# EAGLE design duck_esp (EAGLE 9.6.2)
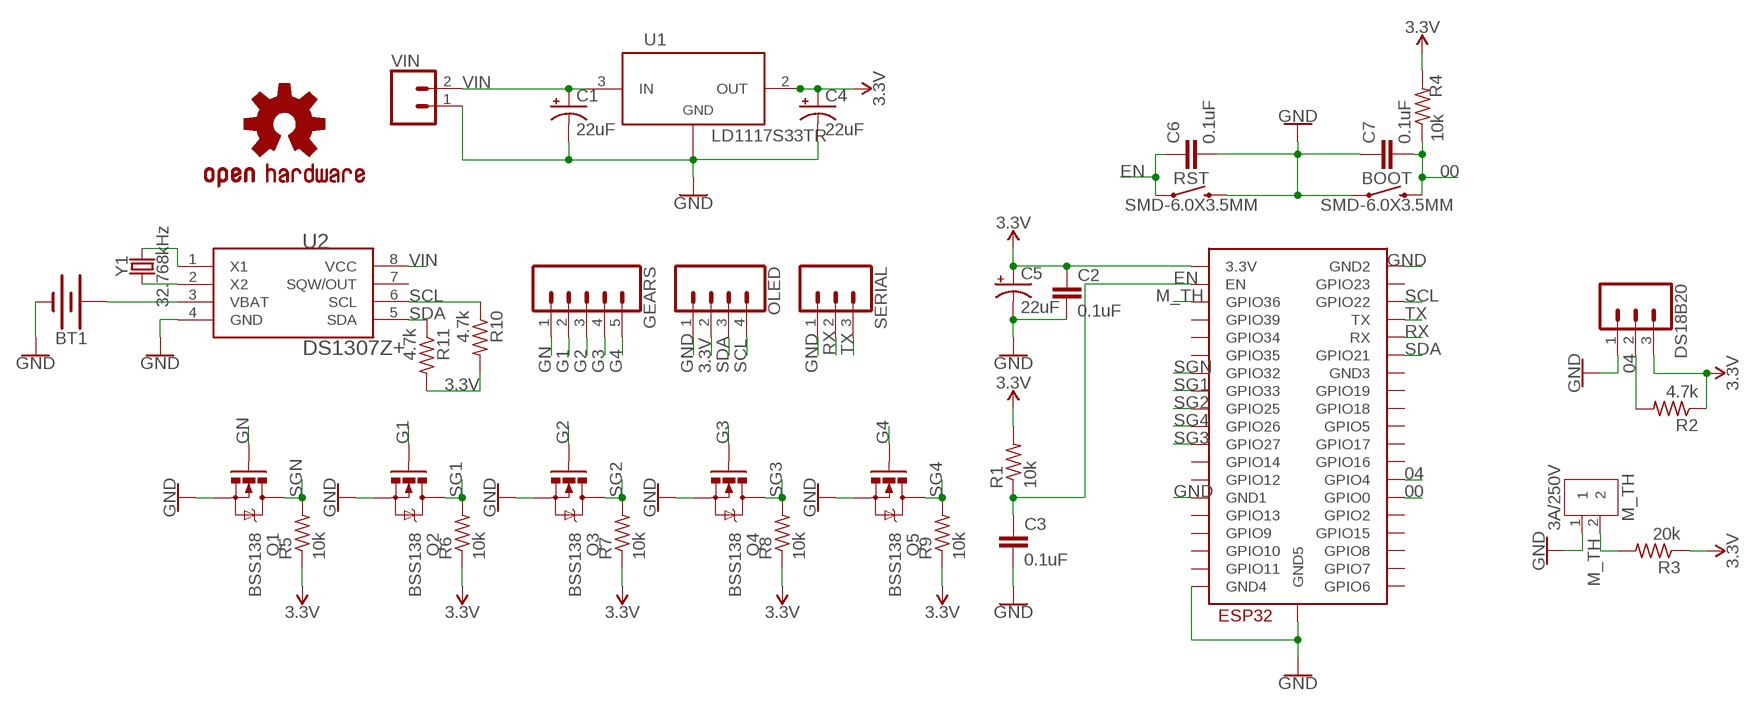
[diagram p0: schematic, sheet 1]

## Parts
BOOT  SMD-6.0X3.5MM  MOMENTARY-SWITCH-SPST-SMD-6.0X3.5MM  [TACTILE_SWITCH_SMD_6.0X3.5MM]
BT1  BATTERY-12MM_SMD  [BATTCON_12MM]
C1  22uF  CPOL-USE2-5  [E2-5]
C2  0.1uF  22UF-0805-6.3V-20%  [0805]
C3  0.1uF  22UF-0805-6.3V-20%  [0805]
C4  22uF  CPOL-USE2-5  [E2-5]
C5  22uF  CPOL-USE2-5  [E2-5]
C6  0.1uF  22UF-0805-6.3V-20%  [0805]
C7  0.1uF  22UF-0805-6.3V-20%  [0805]
DS18B20  CONN_03  [1X03]
GEARS  CONN_05  [1X05]
LOGO1  OSHW-LOGOL-COPPER  [OSHW-LOGO-L_COPPER]
M_TH  3A/250V  B2B-XH-A  [B2B-XH-A]
OLED  CONN_04  [1X04]
Q1  BSS138  MOSFET-NCHANNELBSS138  [SOT23]
Q2  BSS138  MOSFET-NCHANNELBSS138  [SOT23]
Q3  BSS138  MOSFET-NCHANNELBSS138  [SOT23]
Q4  BSS138  MOSFET-NCHANNELBSS138  [SOT23]
Q5  BSS138  MOSFET-NCHANNELBSS138  [SOT23]
R1  10k  R-US_R0805  [R0805]
R2  4.7k  R-US_R0805  [R0805]
R3  20k  R-US_R0805  [R0805]
R4  10k  R-US_R0805  [R0805]
R5  10k  R-US_R0805  [R0805]
R6  10k  R-US_R0805  [R0805]
R7  10k  R-US_R0805  [R0805]
R8  10k  R-US_R0805  [R0805]
R9  10k  R-US_R0805  [R0805]
R10  4.7k  R-US_R0805  [R0805]
R11  4.7k  R-US_R0805  [R0805]
RST  SMD-6.0X3.5MM  MOMENTARY-SWITCH-SPST-SMD-6.0X3.5MM  [TACTILE_SWITCH_SMD_6.0X3.5MM]
SERIAL  CONN_03  [1X03]
U1  LD1117S33TR  [SOT-223]
U2  DS1307Z+  [SOIC-8N]
U$1  ESP32-WROOM  [ESP32-WROOM]
VIN  CONN_02POLAR  [MOLEX-1X2]
Y1  32.768kHz  CRYSTAL-32.768KHZSMD-2X6  [CRYSTAL-SMD-2X6-CYL]

## Nets
00: BOOT.2 C7.2 R4.1 U$1.IO0(GPIO0)
3.3V: C2.1 C4.+ C5.+ DS18B20.3 OLED.2 R1.2 R2.1 R3.1 R4.2 R5.1 R6.1 R7.1 R8.1 R9.1 R10.2 R11.2 U1.2(OUT) U1.4 U$1.3V3(3.3V)
04: DS18B20.2 R2.2 U$1.IO4(GPIO4)
EN: C3.1 C6.1 R1.1 RST.1 U$1.EN
G1: GEARS.2 Q2.1(G)
G2: GEARS.3 Q3.1(G)
G3: GEARS.4 Q4.1(G)
G4: GEARS.5 Q5.1(G)
GN: GEARS.1 Q1.1(G)
GND: BOOT.1 BT1.GND(-) C1.- C2.2 C3.2 C4.- C5.- C6.2 C7.1 DS18B20.1 M_TH.1 OLED.1 Q1.2(S) Q2.2(S) Q3.2(S) Q4.2(S) Q5.2(S) RST.2 SERIAL.1 U1.1(ADJ/GND) U2.4(GND) U$1.GND1 U$1.GND2 U$1.GND4 U$1.GND5 VIN.1
M_TH: M_TH.2 R3.2 U$1.SENSOR_VP(GPIO36)
RX: SERIAL.2 U$1.RX
SCL: OLED.4 R10.1 U2.6(SCL) U$1.IO22(GPIO22)
SDA: OLED.3 R11.1 U2.5(SDA) U$1.IO21(GPIO21)
SG1: Q2.3(D) R6.2 U$1.IO33(GPIO33)
SG2: Q3.3(D) R7.2 U$1.IO25(GPIO25)
SG3: Q4.3(D) R8.2 U$1.IO27(GPIO27)
SG4: Q5.3(D) R9.2 U$1.IO26(GPIO26)
SGN: Q1.3(D) R5.2 U$1.IO32(GPIO32)
TX: SERIAL.3 U$1.TX
VBAT: BT1.PWR@1(+) U2.3(VBAT)
VIN: C1.+ U1.3(IN) U2.8(VCC) VIN.2
X1: U2.1(X1) Y1.X2
X2: U2.2(X2) Y1.X1
Unconnected: U2.7(SQW/OUT) U$1.CLK(GPIO6) U$1.CMD(GPIO11) U$1.GND3 U$1.IO2(GPIO2) U$1.IO5(GPIO5) U$1.IO12(GPIO12) U$1.IO13(GPIO13) U$1.IO14(GPIO14) U$1.IO15(GPIO15) U$1.IO16(GPIO16) U$1.IO17(GPIO17) U$1.IO18(GPIO18) U$1.IO19(GPIO19) U$1.IO23(GPIO23) U$1.IO34(GPIO34) U$1.IO35(GPIO35) U$1.SD0(GPIO7) U$1.SD1(GPIO8) U$1.SD2(GPIO9) U$1.SD3(GPIO10) U$1.SENSOR_VN(GPIO39)

## Library data of the parts
BOOT RST = SparkFun-Switches:MOMENTARY-SWITCH-SPST: Momentary Switch (Pushbutton) - SPST Normally-open (NO) SPST momentary switches (buttons, pushbuttons). Variants PTH-12MM - 12mm square, through-hole Momentary Pushbutton Switch - 12mm Square <https://www.sparkfun.com/products/9190> (COM-09190) PTH-6.0MM, PTH-6.0MM-KIT - 6.0mm square, through-hole Mini Pushbutton Switch <https://www.sparkfun.com/products/97> (COM-00097) KIT package intended for soldering kit's - only one side of pads' copper is exposed. PTH-RIGHT-ANGLE-KIT - Right-angle, through-hole Right Angle Tactile Button <https://www.sparkfun.com/products/10791> - Used on SparkFun BigTime Watch Kit <https://www.sparkfun.com/products/11734> SMD-12MM - 12mm square, surface-mount Tactile Button - SMD (12mm) <https://www.sparkfun.com/products/12993> (COM-12993) Used on SparkFun PicoBoard <https://www.sparkfun.com/products/11888> SMD-4.5MM - 4.5mm Square Trackball Switch Used on SparkFun Blackberry Trackballer Breakout <https://www.sparkfun.com/products/13169> SMD-4.6MMX2.8MM - 4.60mm x 2.80mm, surface mount Used on SparkFun SAMD21 Mini Breakout <https://www.sparkfun.com/products/13664> SMD-5.2MM, SMD-5.2-REDUNDANT - 5.2mm square, surface-mount Mini Pushbutton Switch - SMD <https://www.sparkfun.com/products/8720> (COM-08720) Used on Arduino Pro Mini <https://www.sparkfun.com/products/11114> REDUNDANT package connects both switch circuits together SMD-6.0X3.5MM - 6.0 x 3.5mm, surface mount Momentary Reset Switch SMD <https://www.sparkfun.com/products/8229> (COM-08229) SMD-6.2MM-TALL - 6.2mm square, surface mount Tactile Button - SMD (6mm) <https://www.sparkfun.com/products/12992> Used on SparkFun Digital Sandbox <https://www.sparkfun.com/products/12651> SMD-RIGHT-ANGLE - Right-angle, surface mount Used on SparkFun Block for Intel® Edison - Arduino <https://www.sparkfun.com/products/13036>; PROD_ID: SWCH-00815; SF_SKU: COM-08229
BT1 = SparkFun-Batteries:BATTERY: Battery - Single Cell A variety of battery chemistries, sizes, and footprints. Device List: 20MM_PTH - Coin Cell Battery Holder - 20mm (PTH) <https://www.sparkfun.com/products/783> 6.8MM_PTH - Coin Cell Battery Holder - 6.8MM(SMD) <https://www.digikey.com/product-detail/en/seiko-instruments/MS621FE-FL11E/728-1057-ND/1889208?WT.srch=1&gclid=CNOQ5a6LzdQCFZS2wAodXCkE0g> 12MM_SMD - Coin Cell Battery Holder - 12mm (SMD) <https://www.sparkfun.com/products/10592> 12MM_PTH - Coin Cell Battery Holder - 12mm (PTH) <https://www.sparkfun.com/products/7948> 20MM_SMD - 20mm Coin Cell Battery Holder (SMD) (2 legs) Used on the Big Time Watch Kit <https://www.sparkfun.com/products/11734> 20MM_SMD_4LEGS - Coin Cell Battery Holder - 20mm (SMD) <https://www.sparkfun.com/products/11892> 20MM_SMD_4LEGS_OVERPASTE - Coin Cell Battery Holder - 20mm (SMD) <https://www.sparkfun.com/products/11892> (Over-paste on the legs) 24.5MM_PTH - Coin Cell Battery Holder - 24.5mm (PTH) <https://www.sparkfun.com/products/8863> 9V - 9V Battery Holder - PC Mount Used on the SparkFun SparkPunk Sound Kit <https://www.sparkfun.com/products/11177> and SparkFun SparkPunk Sequencer Kit <https://www.sparkfun.com/products/12707> 18650 - Battery Holder - 18650 (PTH) <https://www.sparkfun.com/products/13113> AA - Battery Holder - 1xAA (PTH) <https://www.sparkfun.com/products/7949> AAA - Battery Holder - 1xAAA (PTH) <https://www.sparkfun.com/products/12718> AA_KIT - Battery Holder - 1xAA (PTH) <https://www.sparkfun.com/products/7949> Special kit package - pads only have exposed copper on one side of the board. AAA_KIT - Battery Holder - 1xAAA (PTH) <https://www.sparkfun.com/products/12718> Special kit package - pads only have exposed copper on one side of the board.; PROD_ID: BATT-08044; SF_SKU: PRT-10592
C1 C4 C5 = rcl:CPOL-US: POLARIZED CAPACITOR, American symbol; SPICEPREFIX: C
C2 C3 C6 C7 = SparkFun-Capacitors:22UF: 22µF ceramic capacitors A capacitor is a passive two-terminal electrical component used to store electrical energy temporarily in an electric field.; PROD_ID: CAP-08402; VALUE: 22uF
DS18B20 SERIAL = SparkFun-Connectors:CONN_03: Multi connection point. Often used as Generic Header-pin footprint for 0.1 inch spaced/style header connections On any of the 0.1 inch spaced packages, you can populate with these: Break Away Headers - Straight <https://www.sparkfun.com/products/116> (PRT-00116) Break Away Male Headers - Right Angle <https://www.sparkfun.com/products/553> (PRT-00553) Female Headers <https://www.sparkfun.com/products/115> (PRT-00115) Break Away Headers - Machine Pin <https://www.sparkfun.com/products/117> (PRT-00117) Break Away Female Headers - Swiss Machine Pin <https://www.sparkfun.com/products/743> (PRT-00743) Stackable Header - 3 Pin (Female, 0.1") <https://www.sparkfun.com/products/13875> (PRT-13875) For SCREWTERMINALS and SPRING TERMINALS visit here: Screw Terimnals on SparkFun.com <https://www.sparkfun.com/search/results?term=Screw+Terminals> (5mm/3.5mm/2.54mm spacing) This device is also useful as a general connection point to wire up your design to another part of your project. Our various solder wires solder well into these plated through hole pads. Hook-Up Wire - Assortment (Stranded, 22 AWG) <https://www.sparkfun.com/products/11375> (PRT-11375) Hook-Up Wire - Assortment (Solid Core, 22 AWG) <https://www.sparkfun.com/products/11367> (PRT-11367) View the entire wire category on our website here <https://www.sparkfun.com/categories/141> Special notes: Molex polarized connector foot print use with SKU : PRT-08232 with associated crimp pins and housings.
GEARS = SparkFun-Connectors:CONN_05: Multi connection point. Often used as Generic Header-pin footprint for 0.1 inch spaced/style header connections On any of the 0.1 inch spaced packages, you can populate with these: Break Away Headers - Straight <https://www.sparkfun.com/products/116> (PRT-00116) Break Away Male Headers - Right Angle <https://www.sparkfun.com/products/553> (PRT-00553) Female Headers <https://www.sparkfun.com/products/115> (PRT-00115) Break Away Headers - Machine Pin <https://www.sparkfun.com/products/117> (PRT-00117) Break Away Female Headers - Swiss Machine Pin <https://www.sparkfun.com/products/743> (PRT-00743) For SCREWTERMINALS and SPRING TERMINALS visit here: Screw Terimnals on SparkFun.com <https://www.sparkfun.com/search/results?term=Screw+Terminals> (5mm/3.5mm/2.54mm spacing) This device is also useful as a general connection point to wire up your design to another part of your project. Our various solder wires solder well into these plated through hole pads. Hook-Up Wire - Assortment (Stranded, 22 AWG) <https://www.sparkfun.com/products/11375> (PRT-11375) Hook-Up Wire - Assortment (Solid Core, 22 AWG) <https://www.sparkfun.com/products/11367> (PRT-11367) View the entire wire category on our website here <https://www.sparkfun.com/categories/141> Special notes: Molex polarized connector foot print use with SKU : PRT-08231 with associated crimp pins and housings. 1MM SMD Version SKU: PRT-10208
LOGO1 = SparkFun-Aesthetics:OSHW-LOGO: Open-Source Hardware (OSHW) Logo This logo indicates the piece of hardware it is found on incorporates a OSHW license and/or adheres to the definition of open source hardware found here: http://freedomdefined.org/OSHW
M_TH = Connector:B2B-XH-A: XH Connector Top Entry - 2POS Details see: Datasheet <http://www.jst-mfg.com/product/pdf/eng/eXH.pdf>; CATEGORY: CONNECTOR; DESCRIPTION: 2.5mm pitch/disconnectable crimp style connector; MANUFACTURER: JST (XH CONNECTOR); MPN: B2B-XH-A; OPERATING_TEMPERATURE: -25°C ~ 85°C; PART_STATUS: ACTIVE; ROHS_COMPLIANT: COMPLIANT; SERIES: B_B-XH-A; SUB_CATEGORY: Through hole connector; TYPE: top entry
OLED = SparkFun-Connectors:CONN_04: Multi connection point. Often used as Generic Header-pin footprint for 0.1 inch spaced/style header connections On any of the 0.1 inch spaced packages, you can populate with these: Break Away Headers - Straight <https://www.sparkfun.com/products/116> (PRT-00116) Break Away Male Headers - Right Angle <https://www.sparkfun.com/products/553> (PRT-00553) Female Headers <https://www.sparkfun.com/products/115> (PRT-00115) Break Away Headers - Machine Pin <https://www.sparkfun.com/products/117> (PRT-00117) Break Away Female Headers - Swiss Machine Pin <https://www.sparkfun.com/products/743> (PRT-00743) For SCREWTERMINALS and SPRING TERMINALS visit here: Screw Terimnals on SparkFun.com <https://www.sparkfun.com/search/results?term=Screw+Terminals> (5mm/3.5mm/2.54mm spacing) This device is also useful as a general connection point to wire up your design to another part of your project. Our various solder wires solder well into these plated through hole pads. Hook-Up Wire - Assortment (Stranded, 22 AWG) <https://www.sparkfun.com/products/11375> (PRT-11375) Hook-Up Wire - Assortment (Solid Core, 22 AWG) <https://www.sparkfun.com/products/11367> (PRT-11367) View the entire wire category on our website here <https://www.sparkfun.com/categories/141> Special notes: Molex polarized connector foot print use with SKU : PRT-08231 with associated crimp pins and housings. 1MM SMD Version SKU: PRT-10208; PROD_ID: CONN-09696
Q1-Q5 = BeagleBone_Blue_R3:MOSFET-NCHANNEL: Common NMOSFET Parts MFG P/N Store ID Prod ID FDD8780 TRANS-09984 SI7820DN TRANS-11055 FDS6630A IC-08089 2N7002PW TRANS-11151 FQP30N06L COM-10213 TRANS-10060 BSS123LT1G TRANS-08345 BSS138 TRANS-00830 BS170 2N7000; PROD_ID: TRANS-00830
R1-R11 = resistor:R-US_: RESISTOR, American symbol
U1 = IC:LD1117S33TR: IC REG LINEAR 3.3V 800MA SOT223 Manufacturer's datasheet <http://www.st.com/content/ccc/resource/technical/document/datasheet/99/3b/7d/91/91/51/4b/be/CD00000544.pdf/files/CD00000544.pdf/jcr:content/translations/en.CD00000544.pdf>; CREATED_BY: PCBLayout.com; DIGIKEY_PART_NUMBER: 497-1242-2-ND; MANUFACTURER: STMicroelectronics; MPN: LD1117S33TR; PACKAGE: SOT-223
U2 = IC:DS1307Z+: IC RTC CLK/CALENDAR I2C 8-SOIC Manufacturer's datasheet <https://datasheets.maximintegrated.com/en/ds/DS1307.pdf>; CREATED_BY: PCBLayout.com; DIGI-KEY_PART_NUMBER: DS1307Z+-ND; MANUFACTURER: Maxim Integrated; MPN: DS1307Z+; PACKAGE: SOIC-8
U$1 = ESP32:ESP32-WROOM
VIN = SparkFun-Connectors:CONN_02: Multi connection point. Often used as Generic Header-pin footprint for 0.1 inch spaced/style header connections On any of the 0.1 inch spaced packages, you can populate with these: Break Away Headers - Straight <https://www.sparkfun.com/products/116> (PRT-00116) Break Away Male Headers - Right Angle <https://www.sparkfun.com/products/553> (PRT-00553) Female Headers <https://www.sparkfun.com/products/115> (PRT-00115) Break Away Headers - Machine Pin <https://www.sparkfun.com/products/117> (PRT-00117) Break Away Female Headers - Swiss Machine Pin <https://www.sparkfun.com/products/743> (PRT-00743) For SCREWTERMINALS and SPRING TERMINALS visit here: Screw Terimnals on SparkFun.com <https://www.sparkfun.com/search/results?term=Screw+Terminals> (5mm/3.5mm/2.54mm spacing) This device is also useful as a general connection point to wire up your design to another part of your project. Our various solder wires solder well into these plated through hole pads. Hook-Up Wire - Assortment (Stranded, 22 AWG) <https://www.sparkfun.com/products/11375> (PRT-11375) Hook-Up Wire - Assortment (Solid Core, 22 AWG) <https://www.sparkfun.com/products/11367> (PRT-11367) View the entire wire category on our website here <https://www.sparkfun.com/categories/141> Special notes: Molex polarized connector foot print use with: PRT-08233 with associated crimp pins and housings. 2.54_SCREWTERM for use with PRT-10571. 3.5mm Screw Terminal footprints for PRT-08084 5mm Screw Terminal footprints for use with PRT-08432; SF_ID: PRT-09918
Y1 = SparkFun-Clocks:CRYSTAL-32.768KHZ: 32.768kHz Crystal Frequency: 32.768kHz Frequency Stability: ±20ppm Load Capacitance: 12.5pF (PTH-2X6 & SMD-3.2X1.5), 6pF (SMD-2X6) SparkFun Products: SparkFun BigTime Watch Kit <https://www.sparkfun.com/products/11734> SparkFun nRF52832 Breakout <https://www.sparkfun.com/products/13990> SparkFun Real Time Clock Module <https://www.sparkfun.com/products/12708>; PROD_ID: XTAL-07894

## Board
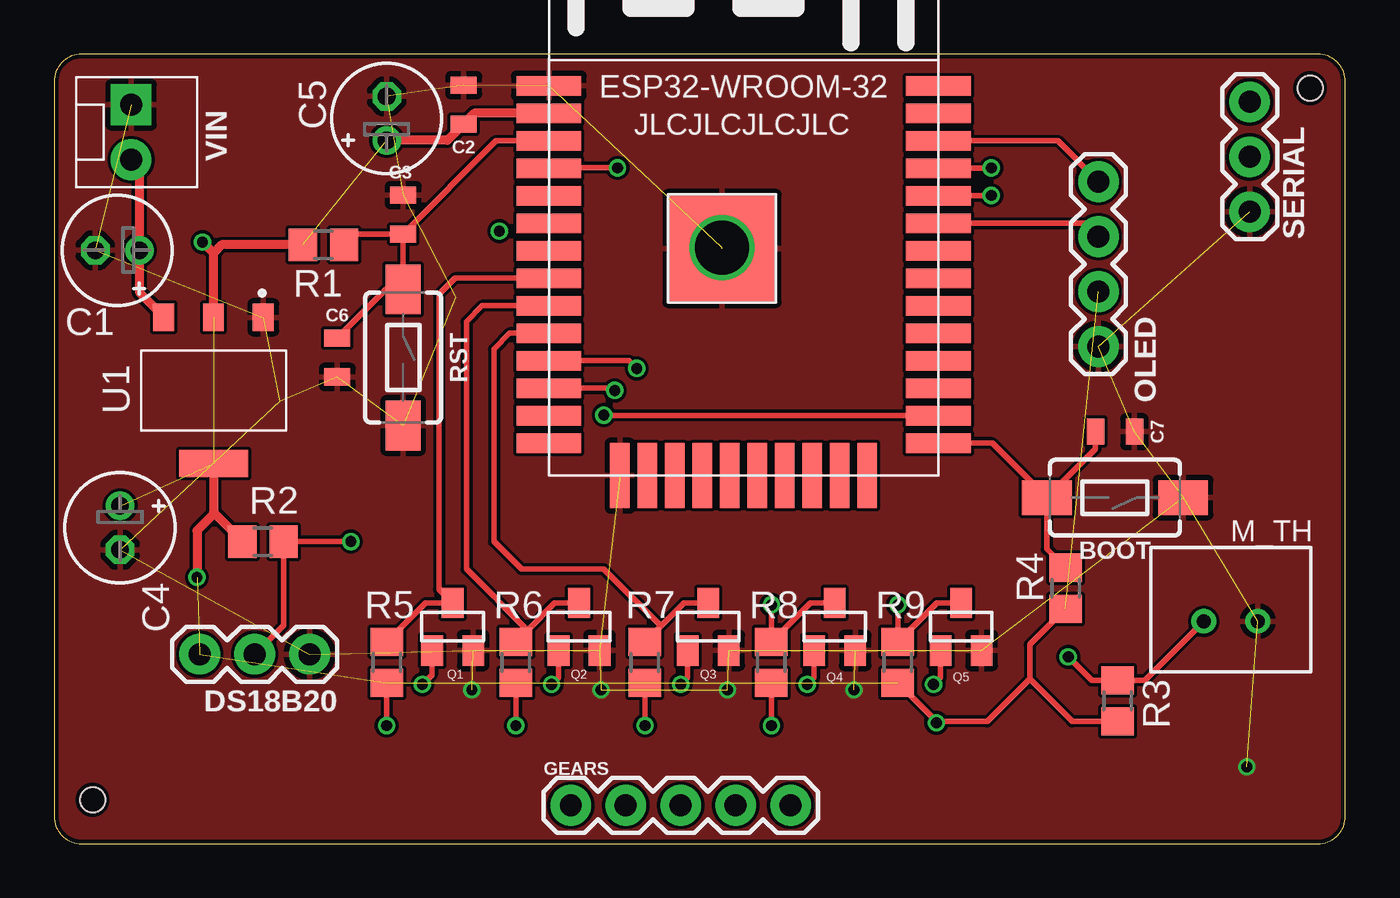
[diagram p1: board, top side]
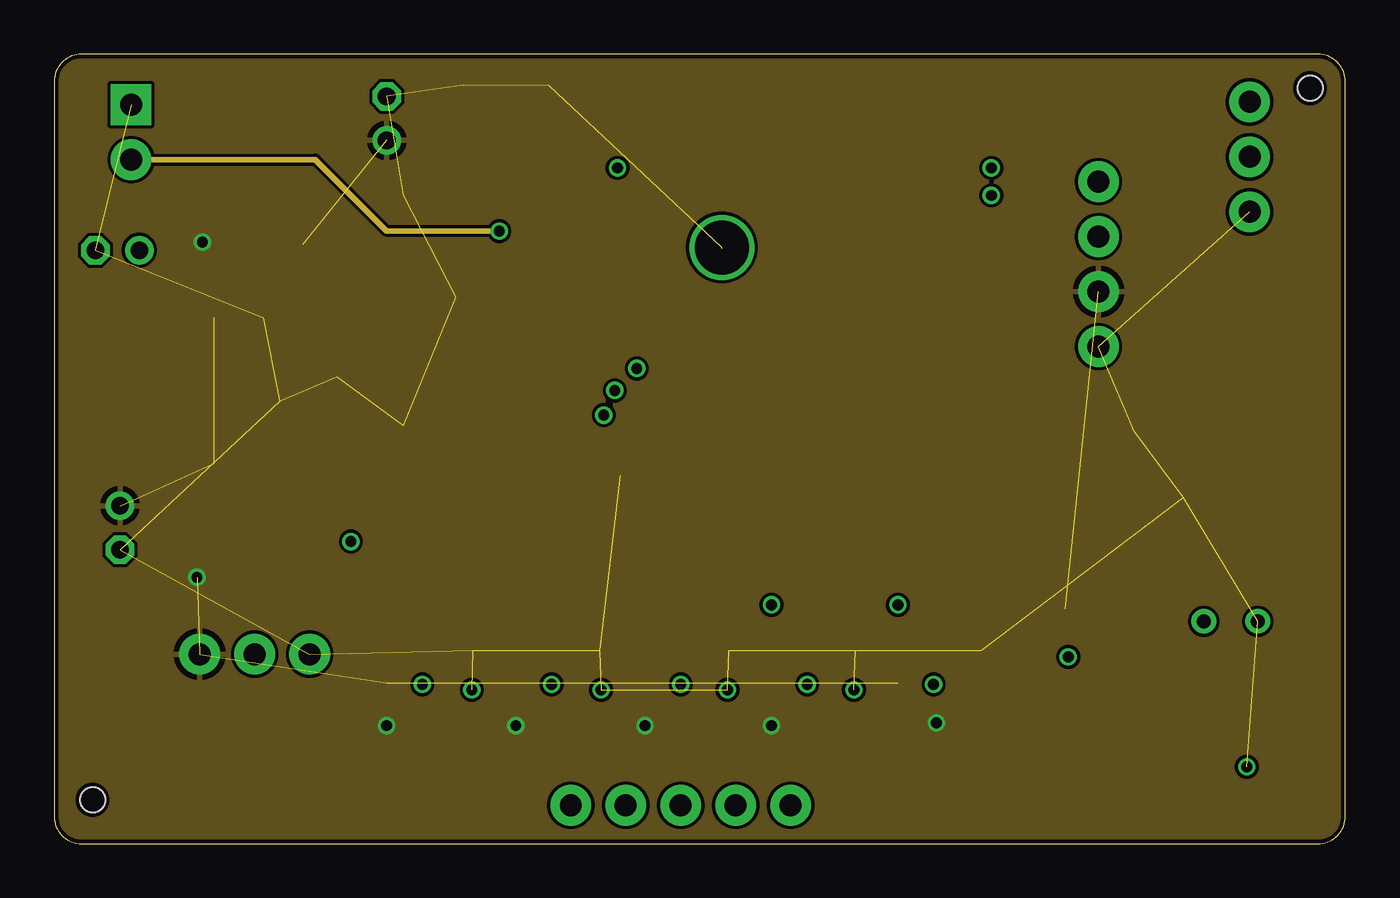
[diagram p2: board, inner layer Route2]
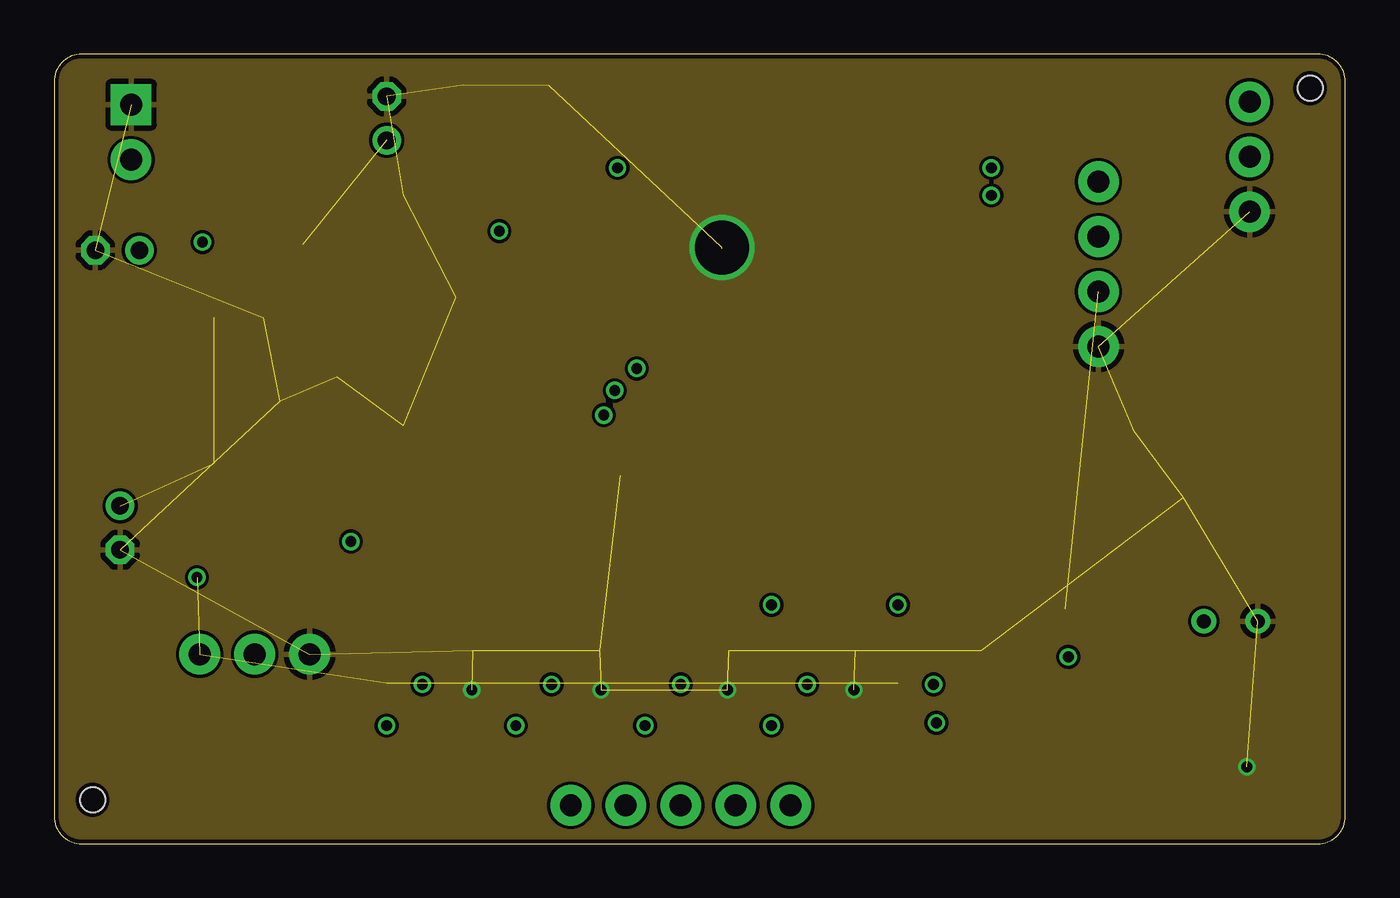
[diagram p3: board, inner layer Route15]
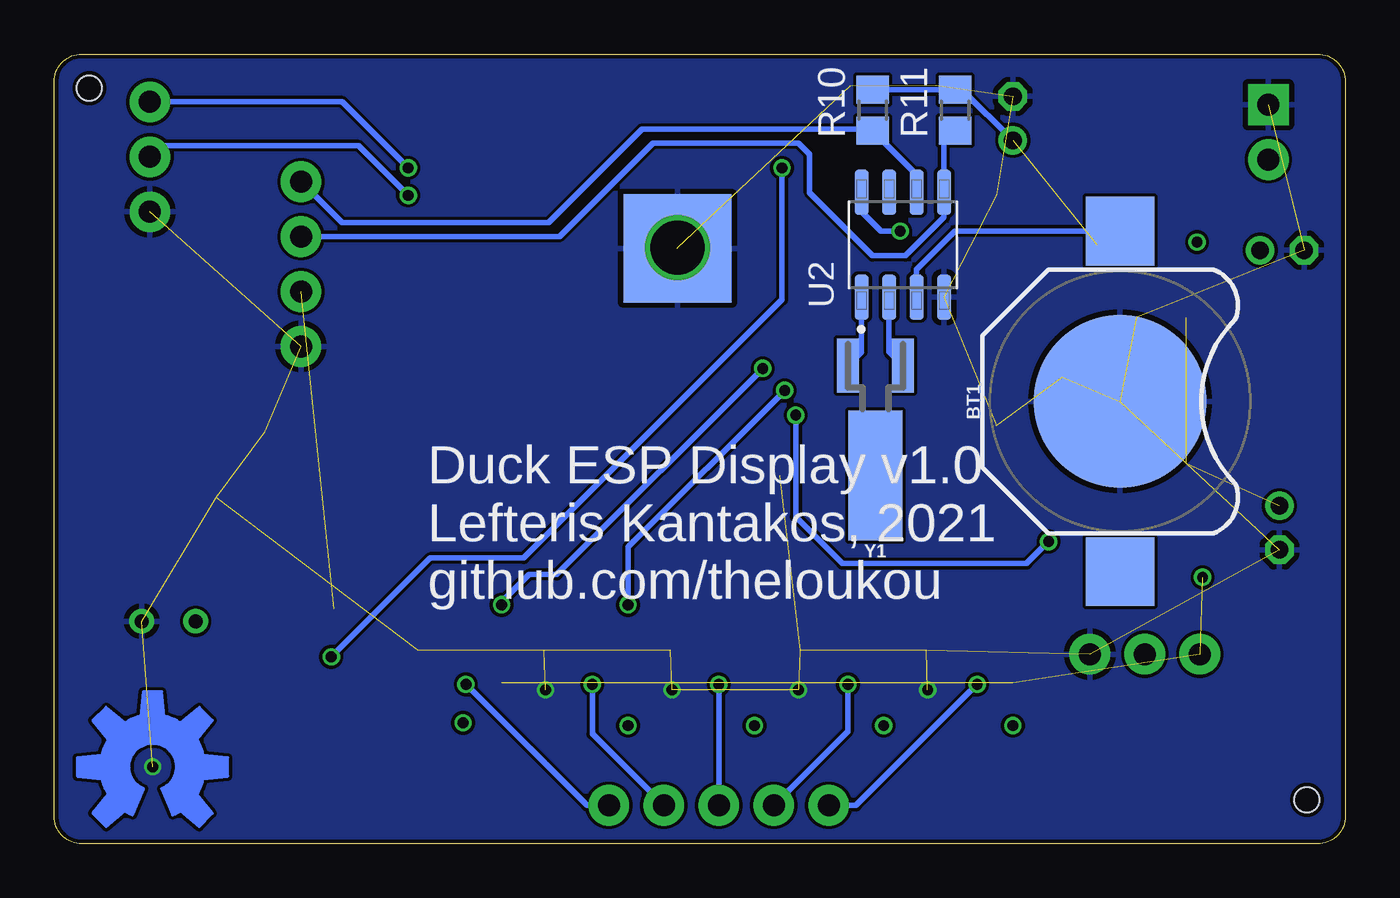
[diagram p4: board, bottom side, seen from below]

Size 59.67 x 36.5 mm. Coordinates in mm from the lower left corner, seen from the top.
Outline: 0,35.23 0,1.27 arc90 1.27,0 58.4,0 arc90 59.67,1.27 59.67,35.23 arc90 58.4,36.5 1.27,36.5 arc90 0,35.23
Copper layers (1*2*15*16): Top 0.035mm / dielectric 0.2mm / Route2 0.018mm / dielectric 1.5mm / Route15 0.018mm / dielectric 0.2mm / Bottom 0.035mm
Design rules "aisler_4_layer *": minimum track width 0.1mm, minimum drill 0.2mm, track to track 0.15mm, track to pad 0.1mm, pad to pad 0.1mm, via to via 0.1mm, smd to smd 0.1mm, copper to edge 0.2mm, drill to drill 0.21mm, minimum pad ring 0.25mm, minimum via ring 0.15mm, stop-mask expansion 0mil, vias tented up to drill 0mil, thermal gap 10mil
Holes 1.15 mm at 1.78,2.03 58.04,34.92

### Footprints (pad centres in the part's own frame; a part is rotated, then mirrored left to right if it is on the bottom)
TACTILE_SWITCH_SMD_6.0X3.5MM = smd 2.3 x 1.6: 1 -3.15,0; 2 3.15,0
BATTCON_12MM = smd 8 x 8: GND 0,0 | smd 3.175 x 3.175: PWR@1 -7.874,0; PWR@2 7.874,0
E2-5 = drill 0.813 pad 1.27: + -1.016,0 | drill 0.813 pad 1.27 octagon: - 1.016,0
0805 = smd 0.8 x 1.2: 1 -0.9,0; 2 0.9,0
1X03 = drill 1.016 pad 1.88: 1 0,0; 2 2.54,0; 3 5.08,0
1X05 = drill 1.016 pad 1.88: 1 0,0; 2 2.54,0; 3 5.08,0; 4 7.62,0; 5 10.16,0
B2B-XH-A = drill 0.64: 1 0,0; 2 2.5,0
1X04 = drill 1.016 pad 1.88: 1 0,0; 2 2.54,0; 3 5.08,0; 4 7.62,0
SOT23 = smd 1 x 1.4: 1 -0.95,-1.1; 2 0.95,-1.1; 3 0,1.1
R0805 = smd 1.3 x 1.5: 1 -0.95,0; 2 0.95,0
SOT-223 = smd 1.26 x 0.96: 1 -3.375,2.3; 2 -3.375,0; 3 -3.375,-2.3 | smd 1.26 x 3.19: 4 3.375,0
SOIC-8N = smd 2.07 x 0.65: 1 -2.425,1.905; 2 -2.425,0.635; 3 -2.425,-0.635; 4 -2.425,-1.905; 5 2.425,-1.905; 6 2.425,-0.635; 7 2.425,0.635; 8 2.425,1.905
ESP32-WROOM = smd 3 x 0.9: 3V3 0,16.74; EN 0,15.47; GND1 0,18.01; GND3 18,18.01; IO0 18,1.5; IO4 18,2.77; IO5 18,6.58; IO12 0,1.5; IO14 0,2.77; IO16 18,4.04; IO17 18,5.31; IO18 18,7.85; IO19 18,9.12; IO21 18,11.66; IO22 18,15.47; IO23 18,16.74; IO25 0,6.58; IO26 0,5.31; IO27 0,4.04; IO32 0,9.12; IO33 0,7.85; IO34 0,11.66; IO35 0,10.39; NC 18,10.39; RX 18,12.93; SENSOR_VN 0,12.93; SENSOR_VP 0,14.2; TX 18,14.2 | smd 0.9 x 3: CLK 9.635,0; CMD 8.365,0; GND2 3.285,0; IO2 14.715,0; IO13 4.555,0; IO15 13.445,0; SD0 10.905,0; SD1 12.175,0; SD2 5.825,0; SD3 7.095,0 | smd 5 x 5: GND4 8,10.5 | smd 5 x 5 bottom: GND5 8,10.5
MOLEX-1X2 = drill 1.016 pad 1.88 square: 1 0,0 | drill 1.016 pad 1.88: 2 2.54,0
CRYSTAL-SMD-2X6-CYL = smd 2.5 x 6: SHEILD 0,5.08 | smd 1 x 2.5: X1 -1.27,0; X2 1.27,0

### Placement (x,y rotation side)
BOOT  49.02,16 180 top
BT1  10.41,20.45 270 bottom
C1  2.92,27.43 180 top
C2  18.92,34.16 90 top
C3  16.13,29.08 90 top
C4  3.05,14.61 270 top
C5  15.37,33.53 90 top
C6  13.08,22.48 270 top
C7  49.02,19.05 180 top
DS18B20  11.81,8.76 180 top
GEARS  23.88,1.78 0 top
LOGO1  55.12,3.56 0 bottom
M_TH  55.63,10.29 180 top
OLED  48.26,22.99 90 top
Q1  18.41,10.03 0 top
Q2  24.26,10.03 0 top
Q3  30.23,10.03 0 top
Q4  36.07,10.03 0 top
Q5  41.91,10.03 0 top
R1  12.45,27.69 180 top
R2  9.65,13.97 0 top
R3  49.15,6.6 90 top
R4  46.74,11.81 270 top
R5  15.37,8.38 90 top
R6  21.34,8.38 90 top
R7  27.3,8.38 90 top
R8  33.15,8.38 90 top
R9  38.99,8.38 90 top
R10  21.84,33.91 90 bottom
R11  18.03,33.91 90 bottom
RST  16.13,22.48 270 top
SERIAL  55.24,29.21 90 top
U1  7.37,20.95 270 top
U2  20.45,27.69 90 bottom
U$1  22.86,17.02 0 top
VIN  3.56,34.16 270 top
Y1  21.72,22.1 180 bottom

### Tracks (layer width: path | path; a pad name or v marks a point on that pad's centre or on a via)
00
  Top 0.254: BOOT.2 48.12,18.25 C7.2 | BOOT.2 43.36,18.52 U$1.IO0 | BOOT.2 45.87,13.62 R4.1
3.3V  (via drill 0.5)  (10 unrouted)
  Top 0.254: R5.1 v15.37,5.46 | R6.1 v21.34,5.46 | R7.1 v27.3,5.46 | R8.1 v33.15,5.46 | R9.1 40.77,5.65 | 40.77,5.65 v40.77,5.59 | R4.2 45.09,9.21 45.09,7.62 | 45.09,7.62 43.12,5.65 40.77,5.65 | R3.1 47.05,5.65 45.09,7.62
  Top 0.406: U$1.3V3 19.42,33.76 C2.1 18.17,32.51 C5.+ | U1.4 7.37,15.31 | 7.37,15.31 R2.1 | 7.37,15.31 7.37,15.24 6.6,14.48 v6.6,12.32 | U1.2 7.37,27.3 | 7.37,27.3 v6.86,27.81 | R1.2 7.75,27.69 7.37,27.3
  Bottom 0.254: R10.2 R11.2 17.71,34.86 C5.+
  pour Route2: 0,35.18 0,1.27 arc90 1.27,0 58.42,0 arc90 59.69,1.27 59.69,35.18 arc90 58.42,36.45 1.27,36.45 arc90
04  (via drill 0.5)
  Top 0.254: DS18B20.2 10.6,10.09 R2.2 v13.72,13.97 | U$1.IO4 25.42,19.79 v25.4,19.81
  Bottom 0.254: v25.4,19.81 25.4,15.11 23.24,12.95 14.73,12.95 v13.72,13.97
EN
  Top 0.254: C3.1 20.43,32.49 U$1.EN | C3.1 RST.1 15.33,25.63 C6.1 | R1.1 13.89,28.18 C3.1
G1  (via drill 0.5)
  Top 0.254: Q2.1 23.31,7.69 v22.99,7.37
  Bottom 0.254: GEARS.2 22.99,5.21 v22.99,7.37
G2  (via drill 0.5)
  Top 0.254: Q3.1 29.28,7.69 v28.96,7.37
  Bottom 0.254: v28.96,7.37 GEARS.3
G3  (via drill 0.5)
  Top 0.254: Q4.1 35.12,7.69 v34.8,7.37
  Bottom 0.254: v34.8,7.37 34.8,5.08 GEARS.4
G4  (via drill 0.5)
  Top 0.254: Q5.1 40.96,7.69 v40.64,7.37
  Bottom 0.254: v40.64,7.37 35.05,1.78 GEARS.5
GN  (via drill 0.5)
  Top 0.254: Q1.1 17.46,7.81 v17.02,7.37
  Bottom 0.254: GEARS.1 22.61,1.78 v17.02,7.37
GND  (via drill 0.5, 2.5)  (31 unrouted)
  other vias: 30.86,27.56 19.3,7.11 25.27,7.11 31.11,7.11 36.96,7.11 55.12,3.56
  pour Top: 0,35.18 0,1.27 arc90 1.27,0 58.42,0 arc90 59.69,1.27 59.69,35.18 arc90 58.42,36.45 1.27,36.45 arc90
  pour Bottom: 0,35.18 0,1.27 arc90 1.27,0 58.42,0 arc90 59.69,1.27 59.69,35.18 arc90 58.42,36.45 1.27,36.45 arc90
  pour Route15: 0,35.18 0,1.27 arc90 1.27,0 58.42,0 arc90 59.69,1.27 59.69,35.18 arc90 58.42,36.45 1.27,36.45 arc90
  pour Route15: 0,35.18 0,1.27 arc90 1.27,0 58.42,0 arc90 59.69,1.27 59.69,35.18 arc90 58.42,36.45 1.27,36.45 arc90
M_TH  (via drill 0.5)
  Top 0.254: v26.04,31.24 22.88,31.24 U$1.SENSOR_VP | v46.86,8.64 47.95,7.55 R3.2 50.39,7.55 M_TH.2
  Bottom 0.254: v46.86,8.64 42.29,13.21 37.97,13.21 26.04,25.15 v26.04,31.24
RX  (via drill 0.5)
  Top 0.254: U$1.RX 43.28,29.95 v43.31,29.97
  Bottom 0.254: v43.31,29.97 45.59,32.26 54.74,32.26 SERIAL.2
SCL
  Top 0.254: U$1.IO22 46.38,32.49 OLED.4
  Bottom 0.254: U2.6 19.81,30.93 R10.1 21.91,33.02 32.51,33.02 36.83,28.7 46.35,28.7 OLED.4
SDA
  Top 0.254: U$1.IO21 47.65,28.68 OLED.3
  Bottom 0.254: R11.1 18.54,32.45 U2.5 18.54,28.96 20.32,27.18 21.84,27.18 24.77,30.1 24.77,31.88 25.27,32.38 32,32.38 36.32,28.07 OLED.3
SG1
  Top 0.254: R6.2 21.88,9.87 | 21.88,9.87 23.14,11.13 Q2.3 | U$1.IO33 19.79,24.87 19.05,24.13 19.05,12.7 20.32,11.43 20.62,11.13 21.88,9.87
SG2
  Top 0.254: R7.2 28.04,10.06 | 28.04,10.06 29.11,11.13 Q3.3 | U$1.IO25 21.06,23.6 20.32,22.86 20.32,13.97 21.59,12.7 25.4,12.7 28.04,10.06
SG3  (via drill 0.5)
  Top 0.254: Q4.3 34.95,11.13 R8.2 v33.15,11.05 | U$1.IO27 25.8,21.06 v25.91,20.95
  Bottom 0.254: v25.91,20.95 33.15,13.72 v33.15,11.05
SG4  (via drill 0.5)
  Top 0.254: Q5.3 40.79,11.13 R9.2 v38.99,11.05 | U$1.IO26 26.57,22.33 v26.92,21.97
  Bottom 0.254: v26.92,21.97 36.45,12.45 37.72,12.45 38.99,11.18 v38.99,11.05
SGN
  Top 0.254: R5.2 17.17,11.13 Q1.3 17.78,11.77 17.78,25.4 18.52,26.14 U$1.IO32
TX  (via drill 0.5)
  Top 0.254: U$1.TX 43.28,31.22 v43.31,31.24
  Bottom 0.254: v43.31,31.24 46.35,34.29 SERIAL.3
VBAT
  Bottom 0.254: BT1.PWR@1 18.03,28.32 19.81,26.54 U2.3
VIN  (via drill 0.5)
  Top 0.406: U1.3 5.09,24.35 3.94,25.51 C1.+ 3.94,31.24 VIN.2
  Route2 0.254: v20.57,28.32 15.37,28.32 13.59,30.1 12.06,31.62 VIN.2
  Bottom 0.254: U2.8 22.35,29.21 21.46,28.32 v20.57,28.32
X1
  Bottom 0.254: U2.1 22.35,22.73 Y1.X2
X2
  Bottom 0.254: U2.2 21.08,22.73 Y1.X1

### Text on the board
tNames: JLCJLCJLCJLC
bNames: Duck ESP Display v1.0 / Lefteris Kantakos, 2021 / github.com/theloukou